# EAGLE design delayStarter (EAGLE 9.6.2)
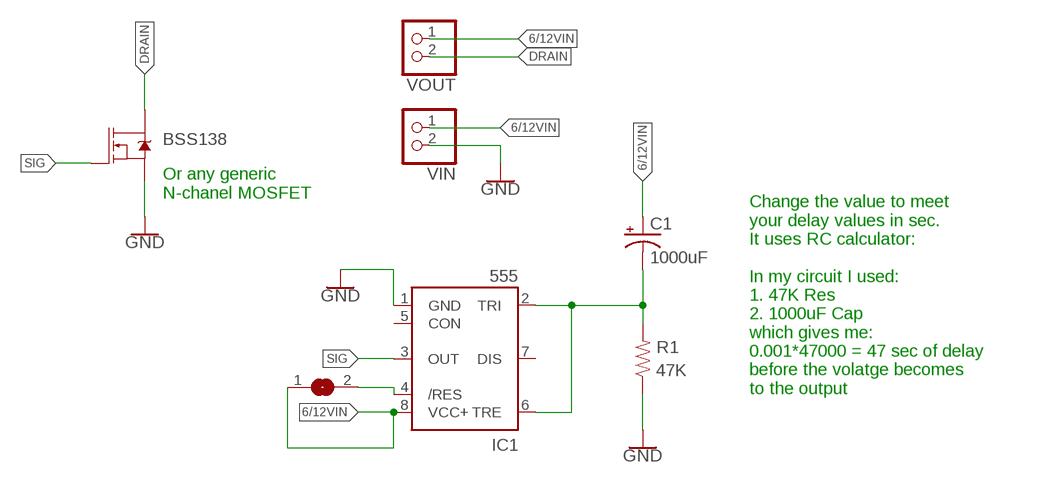
[diagram p0: schematic, sheet 1]

## Parts
BSS138  BSS138  MOSFET-NCH-AO3404A  [SOT23-3]
C1  1000uF  CPOL-US153CLV-0810  [153CLV-0810]
IC1  555  555D  [SO08]
R1  47K  470OHM-0603-1/10W-1%  [0603]
SJ1  JUMPER_SJ  [JUMPER_SJ]
VIN  ONBOARDCONTROLINTERFACE_LED-BADGE_SCHEMATIC_ADAFRUIT_JST_2PIN-SMT-RA  [ONBOARDCONTROLINTERFACE_LED-BADGE_SCHEMATIC_ADAFRUIT_JST-PH-2-SMT-RA]
VOUT  ONBOARDCONTROLINTERFACE_LED-BADGE_SCHEMATIC_ADAFRUIT_JST_2PIN-SMT-RA  [ONBOARDCONTROLINTERFACE_LED-BADGE_SCHEMATIC_ADAFRUIT_JST-PH-2-SMT-RA]

## Nets
6/12VIN: C1.+ IC1.8(VCC+) SJ1.1 VIN.1 VOUT.1
DRAIN: BSS138.3(D) VOUT.2
GND: BSS138.2(S) IC1.1(GND) R1.1 VIN.2
N$1: C1.- IC1.2(TRI) IC1.6(TRE) R1.2
N$2: IC1.4(/RES) SJ1.2
SIG: BSS138.1(G) IC1.3(OUT)
Unconnected: IC1.5(CON) IC1.7(DIS)

## Notes on the sheet
- Or any generic 
  N-chanel MOSFET
- Change the value to meet 
  your delay values in sec. 
  It uses RC calculator:
  
  In my circuit I used:
  1. 47K Res 
  2. 1000uF Cap 
  which gives me:
  0.001*47000 = 47 sec of delay
  before the volatge becomes
  to the output

## Library data of the parts
BSS138 = SparkFun-DiscreteSemi:MOSFET-NCH: N-channel MOSFETs Voltage controlled devices that allow control of high current outputs. SparkFun Products: SparkFun OpenScale <https://www.sparkfun.com/products/13261> SparkFun Digital Sandbox <https://www.sparkfun.com/products/12651> SparkFun Monster Moto Shield <https://www.sparkfun.com/products/10182> SparkFun MOSFET Power Controller <https://www.sparkfun.com/products/11214>; PROD_ID: TRANS-12988; VALUE: 5.8A/30V/35mΩ
C1 = adafruit:CPOL-US: POLARIZED CAPACITOR, American symbol
IC1 = SparkFun-IC-Special-Function:555: General purpose bipolar Timer Datasheet <http://www.sparkfun.com/datasheets/Components/General/ne555.pdf> SparkFun Products SparkFun SparkPunk Sequencer Kit <https://www.sparkfun.com/products/12707> (KIT-12707) Storefront Component: 555 Timer <https://www.sparkfun.com/products/9273> (COM-09273) Two parts valid for production: VFP: IC-11930 (M7555 PTH) VFP: IC-09173 (555 PTH) - Preferred; PROD_ID: NA-XXXXX
R1 = 3-5-pin-smd:470OHM: 470Ω resistor A resistor is a passive two-terminal electrical component that implements electrical resistance as a circuit element. Resistors act to reduce current flow, and, at the same time, act to lower voltage levels within circuits. - Wikipedia; PROD_ID: RES-07869; VALUE: 470
SJ1 = AirPocketCell:JUMPER_SJ: SMD solder JUMPER
VIN VOUT = PiHat:ONBOARDCONTROLINTERFACE_LED-BADGE_SCHEMATIC_ADAFRUIT_JST_2PIN: JST 2-Pin Connectors of various flavors SMT-RA (S2B-PH-SM4) 4UConnector #17311 SMT (B2B-PH-SM4) THM-RA (S2B-PH) THM (B2B-PH)

## Board
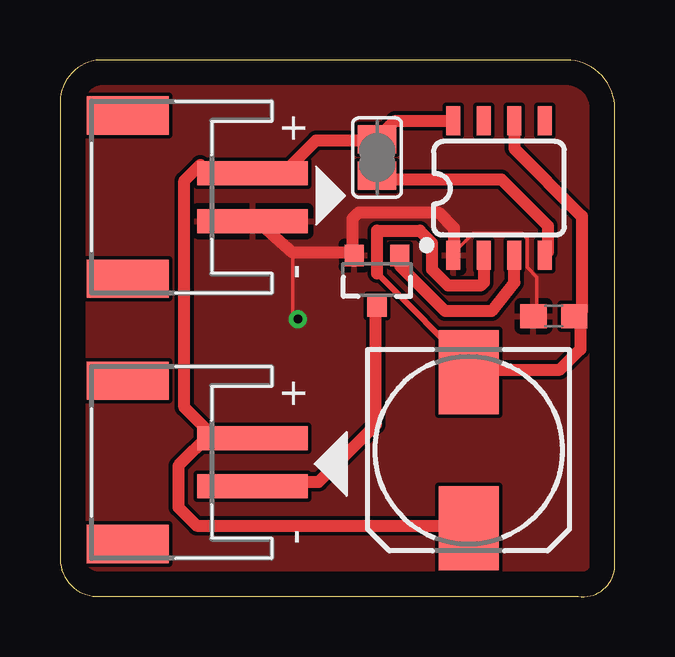
[diagram p1: board, top side]
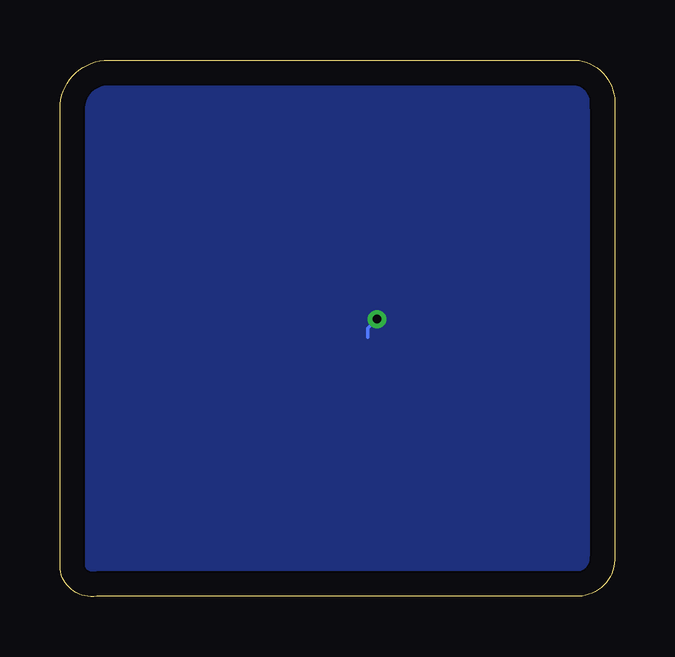
[diagram p2: board, bottom side, seen from below]

Size 23.12 x 22.36 mm. Coordinates in mm from the lower left corner, seen from the top.
Outline: 0,20.46 0,1.54 arc90 1.66,0.01 21.59,0.01 arc90 23.12,1.16 23.12,20.33 arc90 21.09,22.36 1.66,22.36 arc90 0,20.46
Copper layers (1*16): Top 0.035mm / dielectric 1.5mm / Bottom 0.035mm
Design rules "default *": minimum track width 6mil, minimum drill 0.35mm, track to track 6mil, track to pad 6mil, pad to pad 6mil, via to via 6mil, smd to smd 6mil, copper to edge 40mil, drill to drill 6mil, minimum pad ring 10mil, minimum via ring 8mil, stop-mask expansion 4mil, vias tented up to drill 0.35mm, thermal gap 10mil

### Footprints (pad centres in the part's own frame; a part is rotated, then mirrored left to right if it is on the bottom)
SOT23-3 = smd 0.8 x 0.9: 1 -0.95,-1; 2 0.95,-1; 3 0,1.1
153CLV-0810 = smd 3.5 x 2.5: + 3.25,0; - -3.25,0
SO08 = smd 0.6 x 1.2: 1 -1.905,-2.8; 2 -0.635,-2.8; 3 0.635,-2.8; 4 1.905,-2.8; 5 1.905,2.8; 6 0.635,2.8; 7 -0.635,2.8; 8 -1.905,2.8
0603 = smd 1.1 x 1: 1 -0.85,0; 2 0.85,0
JUMPER_SJ = smd 1.168 x 1.6: 1 -0.762,0; 2 0.762,0
ONBOARDCONTROLINTERFACE_LED-BADGE_SCHEMATIC_ADAFRUIT_JST-PH-2-SMT-RA = smd 1 x 4.6: 1 1,-3.7; 2 -1,-3.7 | smd 1.6 x 3.4: NC1 -3.4,1.5; NC2 3.4,1.5

### Placement (x,y rotation side)
BSS138  13.21,13.22 180 top
C1  17.02,6.11 270 top
IC1  18.29,17.03 0 top
R1  20.58,11.7 0 top
SJ1  13.21,18.3 270 top
VIN  4.32,16.65 90 top
VOUT  4.32,5.6 90 top

### Tracks (layer width: path | path; a pad name or v marks a point on that pad's centre or on a via)
6/12VIN
  Top 0.152: 16.21,19.82 IC1.8 | 13.16,19.01 SJ1.1 | 6.66,6.41 7.88,6.41 VOUT.1 6.66,6.41 | 17.02,2.96 C1.+ | 5.85,18 6.59,18 VIN.1 | 6.66,6.41 6.28,6.79
  Top 0.508: 16.21,19.82 13.97,19.82 SJ1.1 | 13.16,19.01 10.67,19.01 9.31,17.65 VIN.1 | 17.02,2.96 5.69,2.96 4.93,3.72 4.93,5.45 6.28,6.79 5.19,7.89 5.19,17.34 5.85,18
DRAIN
  Top 0.152: 13.16,12.1 BSS138.3 | 8.08,4.79 VOUT.2
  Top 0.508: 13.16,12.1 13.16,7.18 10.77,4.79 8.08,4.79
GND  (via drill 0.35)
  Top 0.152: R1.1 19.87,11.88 19.87,13.32 19.46,13.73 19.46,14.95 19.26,15.15 17.23,15.15 16.41,14.34 IC1.1 | 12.15,14.34 BSS138.2 | VIN.2 8.23,15.65 | 9.71,14.34 9.71,11.77 v9.91,11.57
  Top 0.508: 12.15,14.34 9.71,14.34 8.23,15.65 | BSS138.2 12.2,14.29 12.2,15.76 12.45,16.01 15.75,16.01 16.41,15.35 16.41,14.34
  Bottom 0.152: v9.91,11.57 10.29,11.19 10.29,10.81
  pour Top: -0.63,22.62 -0.63,0.27 arc90 0.26,-0.62 23.25,-0.62 arc90 23.88,0.01 23.88,21.6 arc90 22.1,23.38 0.64,23.38 arc-90 0.39,23.13 -0.12,23.13 arc90
  pour Bottom: -1.27,22.24 -1.27,-0.24 -1.01,-0.5 0.13,-1.64 22.36,-1.64 23.75,-0.24 24.77,-0.24 24.77,22.87 24.39,23.25 22.74,24.9 0.89,24.9 -1.27,22.75
N$1
  Top 0.152: 21.75,11.89 21.56,11.7 R1.2 | 17.02,9.46 17.23,9.46 C1.- 17.02,9.46
  Top 0.254: 17.23,9.46 13.21,13.47
  Top 0.508: R1.2 21.68,11.44 21.68,10.31 20.83,9.46 17.23,9.46 | IC1.6 18.93,18.68 21.75,15.86 21.75,11.89 | IC1.2 17.66,13.09 17.53,12.97 16.18,12.97 15.5,13.64 15.5,14.74 14.99,15.25 13.21,15.25 13.21,13.47
N$2
  Top 0.152: 13.36,17.39 SJ1.2
  Top 0.508: IC1.4 20.32,14.36 20.32,15.46 18.39,17.39 13.36,17.39
SIG
  Top 0.152: BSS138.1 14.16,13.79
  Top 0.508: 14.16,13.79 16.06,11.9 17.98,11.9 18.93,13.09 IC1.3